# Altium schematic sheet pca63519 - Sensors.SchDoc: PCA63519 - Smart Remote 3 DK shield - Sensors
size A4; DocumentNumber: 5; Revision: 1.2.1; SheetNumber: 5; SheetTotal: 6; DrawnBy: GETR; ProjectNumber: 4414; DocumentSize: A4; PCBRevision: 0049GETR; PCAName: PCA63519; PCBNumber: 400129
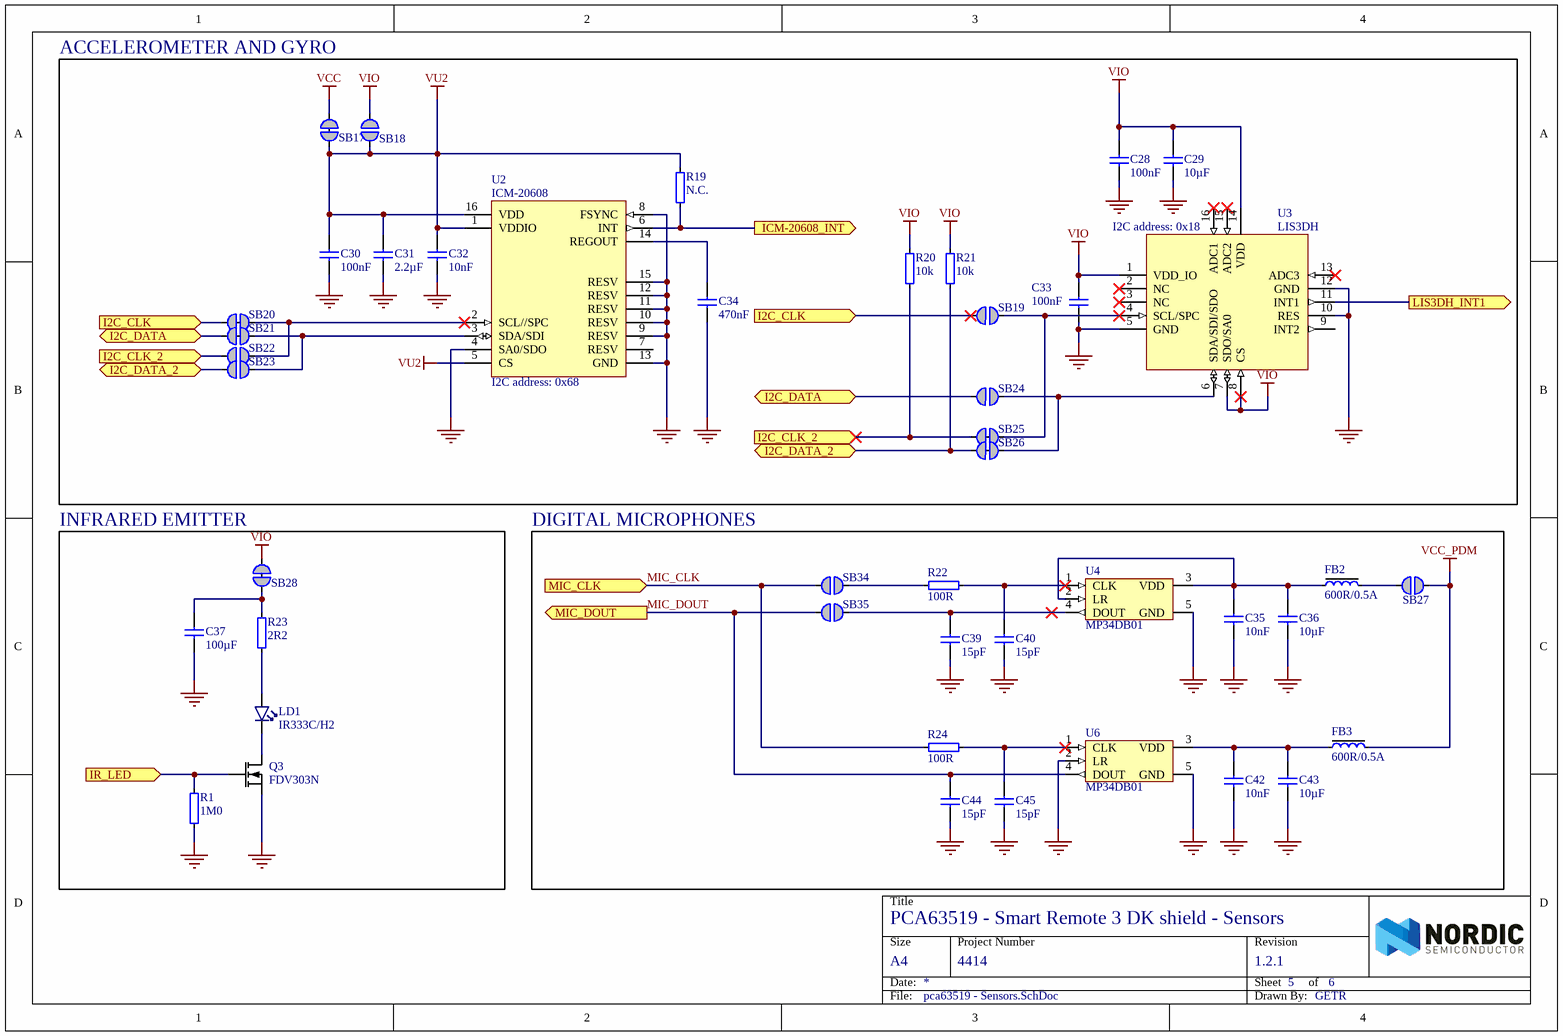
[diagram p0: pca63519 - Sensors.SchDoc]

## Parts
C28  100nF  [CAPC1005X04L]
C29  10µF  [CAPC2012X11L]
C30  100nF  [CAPC1005X04L]
C31  2.2µF  [CAPC1005X04L]
C32  10nF  [CAPC1005X04L]
C33  100nF  [CAPC1005X04L]
C34  470nF  [CAPC1005X04L]
C35  10nF  [CAPC1005X04L]
C36  10µF  [CAPC2012X11L]
C37  100µF  [CAPC3216X13L]
C39  15pF  [CAPC1005X04L]
C40  15pF  [CAPC1005X04L]
C42  10nF  [CAPC1005X04L]
C43  10µF  [CAPC2012X11L]
C44  15pF  [CAPC1005X04L]
C45  15pF  [CAPC1005X04L]
FB2  600R/0.5A  [INDC1608X06L]
FB3  600R/0.5A  [INDC1608X06L]
LD1  IR333C/H2  [LED_3MM_SIDE]
Q3  FDV303N  [SOT-23a]
R1  1M0  [RESC1005X04L]
R19  N.C.  [RESC1005X04L]
R20  10k  [RESC1005X04L]
R21  10k  [RESC1005X04L]
R22  100R  [RESC1005X04L]
R23  2R2  [RESC1005X04L]
R24  100R  [RESC1005X04L]
SB17  Solderbridge  [Solderbridge_SHORTED_0.4]  (value not drawn)  (net tie, no BOM)
SB18  Solderbridge  [Solderbridge_0.4]  (value not drawn)  (no BOM)
SB19  Solderbridge  [Solderbridge_0.4]  (value not drawn)  (no BOM)
SB20  Solderbridge  [Solderbridge_SHORTED_0.4]  (value not drawn)  (net tie, no BOM)
SB21  Solderbridge  [Solderbridge_SHORTED_0.4]  (value not drawn)  (net tie, no BOM)
SB22  Solderbridge  [Solderbridge_0.4]  (value not drawn)  (no BOM)
SB23  Solderbridge  [Solderbridge_0.4]  (value not drawn)  (no BOM)
SB24  Solderbridge  [Solderbridge_0.4]  (value not drawn)  (no BOM)
SB25  Solderbridge  [Solderbridge_SHORTED_0.4]  (value not drawn)  (net tie, no BOM)
SB26  Solderbridge  [Solderbridge_SHORTED_0.4]  (value not drawn)  (net tie, no BOM)
SB27  Solderbridge  [Solderbridge_0.4]  (value not drawn)  (no BOM)
SB28  Solderbridge  [Solderbridge_SHORTED_0.4]  (value not drawn)  (net tie, no BOM)
SB34  Solderbridge  [Solderbridge_0.4]  (value not drawn)  (no BOM)
SB35  Solderbridge  [Solderbridge_0.4]  (value not drawn)  (no BOM)
U2  ICM-20608  [PQFN50P300X300X100-16N]
U3  LIS3DH  [PQFN50P300X300X100-16N]
U4  MP34DB01  [RHLGA-4 (3x4x1mm)]
U6  MP34DB01  [RHLGA-4 (3x4x1mm)]

## Blocks framed on the sheet
ACCELEROMETER AND GYRO: C28-C34 R19-R21 SB17-SB26 U2 U3
INFRARED EMITTER: C37 LD1 Q3 R1 R23 SB28
DIGITAL MICROPHONES: C35 C36 C39 C40 C42-C45 FB2 FB3 R22 R24 SB27 SB34 SB35 U4 U6

## Ports
I2C_CLK (in), I2C_CLK_2 (in), I2C_DATA (bidir), I2C_DATA_2 (bidir), ICM-20608_INT (out), IR_LED (in), LIS3DH_INT1 (out), MIC_CLK (in), MIC_DOUT (out)

## Nets
GND: C28.1 C29.1 C30.1 C31.1 C32.1 C33.1 C34.1 C35.1 C36.1 C37.1 C39.1 C40.1 C42.1 C43.1 C44.1 C45.1 Q3.2(S) R1.1 U2.4(SA0/SDO) U2.8(FSYNC) U2.9(RESV) U2.10(RESV) U2.11(RESV) U2.12(RESV) U2.13(GND) U2.15(RESV) U3.5(GND) U3.10(RES) U3.12(GND) U4.5(GND) U6.2(LR) U6.5(GND)
VCC: SB17.1
VCC_PDM: FB3.2 SB27.1
VIO: C28.2 C29.2 C33.2 R20.2 R21.2 SB18.1 SB28.1 U3.1(VDD_IO) U3.7(SDO/SA0) U3.8(CS) U3.14(VDD)
VU2: C30.2 C31.2 C32.2 R19.2 SB17.2 SB18.2 U2.1(VDDIO) U2.5(CS) U2.16(VDD)
I2C_CLK: SB19.2 SB20.2 ; port I2C_CLK
I2C_CLK_2: R20.1 SB22.1 SB25.2 ; port I2C_CLK_2
I2C_DATA: SB21.2 SB24.2 ; port I2C_DATA
I2C_DATA_2: R21.1 SB23.1 SB26.2 ; port I2C_DATA_2
ICM-20608_INT: R19.1 U2.6(INT) ; port ICM-20608_INT
IR_LED: Q3.1(G) R1.2 ; port IR_LED
LIS3DH_INT1: U3.11(INT1) ; port LIS3DH_INT1
MIC_CLK: R24.1 SB34.2 ; port MIC_CLK
MIC_DOUT: C44.2 SB35.2 U6.4(DOUT) ; port MIC_DOUT
NetC34_2: C34.2 U2.14(REGOUT)
NetC35_2: C35.2 C36.2 FB2.1 U4.2(LR) U4.3(VDD)
NetC37_2: C37.2 R23.2 SB28.2
NetC39_2: C39.2 SB35.1 U4.4(DOUT)
NetC40_2: C40.2 R22.2 U4.1(CLK)
NetC42_2: C42.2 C43.2 FB3.1 U6.3(VDD)
NetC45_2: C45.2 R24.2 U6.1(CLK)
NetFB2_2: FB2.2 SB27.2
NetLD1_1: LD1.1(C) Q3.3(D)
NetLD1_2: LD1.2(A) R23.1
NetR22_1: R22.1 SB34.1
NetSB19_1: SB19.1 SB25.1 U3.4(SCL/SPC)
NetSB20_1: SB20.1 SB22.2 U2.2(SCL//SPC)
NetSB21_1: SB21.1 SB23.2 U2.3(SDA/SDI)
NetSB24_1: SB24.1 SB26.1 U3.6(SDA/SDI/SDO)

Not connected (* = marked no-connect by the designer): U2 7(RESV); U3 2(NC)* 3(NC)* 9(INT2) 13(ADC3)* 15(ADC2)* 16(ADC1)*

## Notes on the sheet
- (near U3) I2C address: 0x18
- (near U2) I2C address: 0x68
- Title
- Size
- Date:
- Project Number
- Sheet         of
- Revision
- File:
- Drawn By:

## Library data of the parts
C28 C30 C33 = C0402-100n: Capacitor, X7R, ±10%; Note: 16V; Artikkelnr Noca: 20039200; Artikkelnr Simpro: N.A.; Part Number: C0402-100n; Manufacturer: *; Manufacturer Part Number: *; Datasheet: *; LatestRevisionDate: 2009-11-23; Pin Count: 2; Publisher: Nordic Semiconductor; Published: 2009-05-08; Value: 100nF; Supplier: *; Supplier part number: *; 2nd source Supplier: *; 2nd source part number: *; Footprint Doc: 0402
C29 C36 C43 = C0805-10µ: Capacitor, X5R, ±10%; Note: 16V; Artikkelnr Noca: 20039243; Artikkelnr Simpro: N.A.; Part Number: C0805-10µ; Manufacturer: *; Manufacturer Part Number: *; Datasheet: *; LatestRevisionDate: 2013-06-04; Pin Count: 2; Publisher: Nordic Semiconductor; Published: 2010-06-03; Value: 10µF; Supplier: *; Supplier part number: *; 2nd source Supplier: *; 2nd source part number: *; Footprint Doc: 0805
C31 = C0402-2µ2: Capacitor, X5R, ±20%; Note: 25V; Artikkelnr Noca: 20030006; Artikkelnr Simpro: N.A.; Part Number: C0402-2µ2; Manufacturer: *; Manufacturer Part Number: *; Datasheet: *; Footprint Doc: 0402; LatestRevisionDate: 2006-06-02; Pin Count: 2; Publisher: Nordic Semiconductor; Published: 2009-05-08; Value: 2.2µF; Supplier: Digi-Key; Supplier part number: 490-10457-1-ND; 2nd source Supplier: *; 2nd source part number: *
C32 C35 C42 = C0402-10n: Capacitor, X7R, ±10%; Note: 16V; Artikkelnr Noca: 20039166; Artikkelnr Simpro: N.A.; Part Number: C0402-10n; Manufacturer: *; Manufacturer Part Number: *; Datasheet: *; Footprint Doc: 0402; LatestRevisionDate: 2009-11-23; Pin Count: 2; Publisher: Nordic Semiconductor; Published: 2009-05-08; Value: 10nF; Supplier: *; Supplier part number: *; 2nd source Supplier: *; 2nd source part number: *
C34 = C0402-470n: Capacitor, X5R, ±10%; Note: 6.3V; Artikkelnr Noca: 20039350; Artikkelnr Simpro: N.A.; Part Number: C0402-470n; Manufacturer: *; Manufacturer Part Number: *; Datasheet: *; Footprint Doc: 0402; LatestRevisionDate: 2015-07-03; Pin Count: 2; Publisher: Nordic Semiconductor; Published: 2009-05-08; Value: 470nF; Supplier: *; Supplier part number: *; 2nd source Supplier: *; 2nd source part number: *
C37 = C1206-100u-6.3V: CAP CER 100UF 6.3V 20% X5R 1206; Manufacturer: Murata Electronics North America; Manufacturer Part Number: GRM31CR60J107ME39L; Artikkelnr Noca: N.A.; Part Number: C1206-100u-6.3V; Datasheet: http://search.murata.co.jp/Ceramy/image/img/A01X/G101/ENG/GRM31CR60J107ME39-01.pdf; Footprint Doc: 1206; LatestRevisionDate: 2015-02-26; Pin Count: 2; Publisher: Nordic Semiconductor; Published: 2015-02-26; Value: 100µF; Note: 6.3V; Supplier: Digi-Key; Supplier part number: 490-4539-2-ND; 2nd source Supplier: *; 2nd source part number: *; Artikkelnr Simpro: N.A.
C39 C40 C44 C45 = C0402-15p: Capacitor, NP0, ±5%; Note: 50V; Artikkelnr Noca: 20029141; Artikkelnr Simpro: N.A.; Part Number: C0402-15p; Manufacturer: *; Manufacturer Part Number: *; Datasheet: *; LatestRevisionDate: 2009-11-23; Pin Count: 2; Publisher: Nordic Semiconductor; Published: 2009-05-08; Value: 15pF; Supplier: *; Supplier part number: *; 2nd source Supplier: *; 2nd source part number: *; Footprint Doc: 0402
FB2 FB3 = FB0603-600R@100MHz-500mA: Ferrite Bead, 600 Ohm @ 100MHz, 500mA, 380 mOhm Max; Manufacturer: Murata; Manufacturer Part Number: BLM18AG601SN1; 2nd source part number: 490-1014-1-ND; Note: Chip EMIFIL Inductor Type Chip Ferrite Bead; Artikkelnr Noca: 37019100; Artikkelnr Simpro: N.A.; Part Number: FB0603-600R@100MHz-500mA; Datasheet: http://www.farnell.com/datasheets/356366.pdf; Footprint Doc: 0603; LatestRevisionDate: 2014-01-10; Pin Count: 2; Publisher: Nordic Semiconductor; Published: 2010-09-02; Value: 600R/0.5A; Supplier: Farnell; Supplier part number: 151-5679; 2nd source Supplier: Digi-Key
LD1 = IR333C/H2_SIDE: IR EMITTER, 3MM, 940NM; Manufacturer: Everlight; Artikkelnr Noca: N.A.; Part Number: IR333C/H2_SIDE; Manufacturer Part Number: IR333C/H2; Datasheet: http://www.everlight.com/file/ProductFile/IR333C-H2.pdf; Footprint Doc: LED_3MM_SIDE; LatestRevisionDate: 2016-03-29; Pin Count: 2; Publisher: Nordic Semiconductor; Published: 2016-03-29; Value: IR333C/H2; Note: *; Supplier: Mouser; Supplier part number: 638-IR333C/H2; 2nd source Supplier: *; 2nd source part number: *; Artikkelnr Simpro: N.A.
Q3 = FDV303N: Mosfet FDV303N; 2nd source part number: FDV303NCT-ND; Note: Schottky; Artikkelnr Noca: 35029048; Artikkelnr Simpro: N.A.; Part Number: FDV303N; Manufacturer: *; Manufacturer Part Number: *; Datasheet: *; LatestRevisionDate: 2009-11-23; Pin Count: 3; Publisher: Nordic Semiconductor; Published: 2009-05-10; Value: FDV303N; Supplier: Farnell; Supplier part number: 984-5020; 2nd source Supplier: Digi-Key; Footprint Doc: SOT-23a
R1 = R0402-1M0: Resistor, ±1%, 0.063W; Note: Chip Res 1%; Artikkelnr Noca: 27049145; Artikkelnr Simpro: N.A.; Value Ohm: 1000000; Part Number: R0402-1M0; Manufacturer: *; Manufacturer Part Number: *; Datasheet: *; Footprint Doc: 0402; LatestRevisionDate: 2009-11-23; Pin Count: 2; Publisher: Nordic Semiconductor; Published: 2009-05-08; Value: 1M0; Supplier: *; Supplier part number: *; 2nd source Supplier: *; 2nd source part number: *
R19 = R0402-N.C.: Not mounted; Note: Chip Res; Artikkelnr Noca: N.A.; Assembly: Not mounted; Part Number: R0402-N.C.; Manufacturer: *; Manufacturer Part Number: *; Datasheet: *; LatestRevisionDate: 2009-05-08; Pin Count: 2; Publisher: Nordic Semiconductor; Published: 2009-05-08; Value: N.C.; Supplier: *; Supplier part number: *; 2nd source Supplier: *; 2nd source part number: *; Footprint Doc: 0402; Artikkelnr Simpro: N.A.
R20 R21 = R0402-10k: Resistor, ±1%, 0.063W; Note: Chip Res 1%; Artikkelnr Noca: 27049097; Artikkelnr Simpro: N.A.; Value Ohm: 10000; Part Number: R0402-10k; Manufacturer: *; Manufacturer Part Number: *; Datasheet: *; LatestRevisionDate: 2009-11-23; Pin Count: 2; Publisher: Nordic Semiconductor; Published: 2009-05-08; Value: 10k; Supplier: Farnell; Supplier part number: 173-8864; 2nd source Supplier: *; 2nd source part number: *; Footprint Doc: 0402
R22 R24 = R0402-100: Resistor, ±1%, 0.063W; Note: Chip Res 1%; Artikkelnr Noca: 27049049; Artikkelnr Simpro: N.A.; Value Ohm: 100; Part Number: R0402-100; Manufacturer: *; Manufacturer Part Number: *; Datasheet: *; LatestRevisionDate: 2009-11-23; Pin Count: 2; Publisher: Nordic Semiconductor; Published: 2009-05-08; Value: 100R; Supplier: Farnell; Supplier part number: 173-8837; 2nd source Supplier: *; 2nd source part number: *; Footprint Doc: 0402
R23 = R0402-2R2: Resistor, ±1%, 0.063W; Note: Chip Res 1%; Artikkelnr Noca: 27049009; Artikkelnr Simpro: N.A.; Value Ohm: 2.2; Part Number: R0402-2R2; Manufacturer: *; Manufacturer Part Number: *; Datasheet: *; LatestRevisionDate: 2012-06-22; Pin Count: 2; Publisher: Nordic Semiconductor; Published: 2012-06-22; Value: 2R2; Supplier: *; Supplier part number: *; 2nd source Supplier: *; 2nd source part number: *; Footprint Doc: 0402
SB17 SB20 SB21 SB25 SB26 SB28 = Solderbridge Shorted 0.4mm: Shorted Solderbridge; Artikkelnr Noca: N.A.; Part Number: Solderbridge Shorted 0.4mm; Manufacturer: *; Manufacturer Part Number: *; Datasheet: *; Footprint Doc: Solderbridge_Shorted; LatestRevisionDate: 2012-08-07; Pin Count: 2; Publisher: Nordic Semiconductor; Published: 2012-08-07; Value: Solderbridge; Note: *; Supplier: *; Supplier part number: *; 2nd source Supplier: *; 2nd source part number: *; Artikkelnr Simpro: N.A.
SB18 SB19 SB22-SB24 SB27 SB34 SB35 = Solderbridge 0.4mm: Artikkelnr Noca: N.A.; Part Number: Solderbridge 0.4mm; Manufacturer: *; Manufacturer Part Number: *; Datasheet: *; Footprint Doc: Solderbridge; LatestRevisionDate: 2009-12-14; Pin Count: 2; Publisher: Nordic Semiconductor; Published: 2009-12-14; Value: Solderbridge; Note: *; Supplier: *; Supplier part number: *; 2nd source Supplier: *; 2nd source part number: *; Artikkelnr Simpro: N.A.
U2 = ICM-20608: Gyroscope and Accelerometer, PQFN-16; Manufacturer: InvenSense; Artikkelnr Noca: N.A.; Part Number: ICM-20608; Manufacturer Part Number: ICM-20608; Datasheet: http://43zrtwysvxb2gf29r5o0athu.wpengine.netdna-cdn.com/wp-content/uploads/2015/03/DS-000081-v1.01.pdf; Footprint Doc: LGA-16; LatestRevisionDate: 2015-02-26; Pin Count: 16; Publisher: Nordic Semiconductor; Published: 2015-02-26; Value: ICM-20608; Note: *; Supplier: Digi-Key; Supplier part number: 1428-1052-1-ND; 2nd source Supplier: *; 2nd source part number: *; Artikkelnr Simpro: N.A.
U3 = LIS3DH: 3-axis - ±2g/±4g/±8g/±16g digital output nano accelerometer; Manufacturer: STMicroelectronics; 2nd source part number: 187-2923; Note: MEMS digital output motion sensor ultra low-power high performance 3-axes "nano" accelerometer; Artikkelnr Noca: 15079978; Artikkelnr Simpro: N.A.; Value: LIS3DH; Part Number: LIS3DH; Manufacturer Part Number: LIS3DH; Datasheet: http://www.st.com/st-web-ui/static/active/en/resource/technical/document/datasheet/CD00274221.pdf; LatestRevisionDate: 2015-01-09; Pin Count: 16; Publisher: Nordic Semiconductor; Published: 2011-08-30; Supplier: Digi-Key; Supplier part number: 497-10613-1-ND; 2nd source Supplier: Farnell; Footprint Doc: LGA-16
U4 U6 = MP34DB01: MEMS audio sensor omnidirectional digital microphone; Manufacturer: STMicroelectronics; Note: Alternative: ADMP421, SPK0833LM4H-B; Artikkelnr Noca: 45019035; Artikkelnr Simpro: N.A.; Part Number: MP34DB01; Manufacturer Part Number: MP34DB01; Datasheet: http://www.st.com/web/en/resource/technical/document/datasheet/CD00284650.pdf; LatestRevisionDate: 2013-09-16; Pin Count: 5; Publisher: Nordic Semiconductor; Published: 2013-09-16; Value: MP34DB01; Supplier: Digi-Key; Supplier part number: 497-11241-1-ND; 2nd source Supplier: *; 2nd source part number: *; Footprint Doc: RHLGA-4